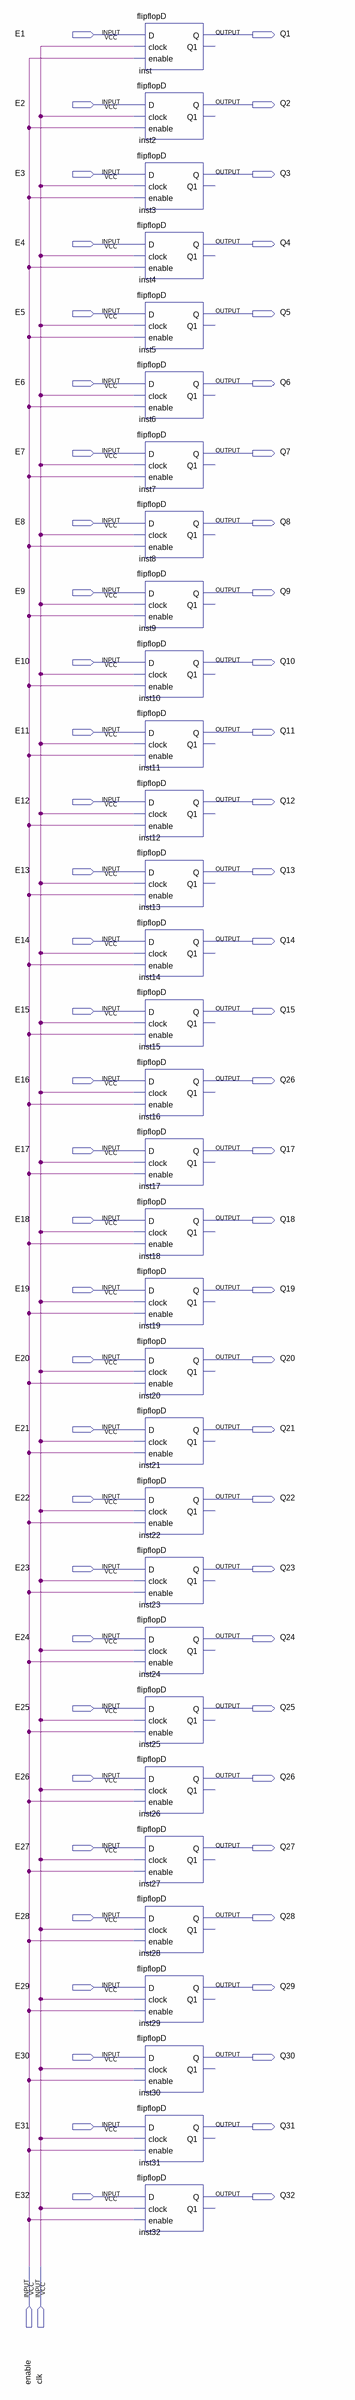
[diagram p0: schematic sheet]
// Quartus schematic reg32.bdf as structural Verilog: 32 symbols, 66 pins
module reg32 (
  input  E1,
  input  E2,
  input  E3,
  input  E4,
  input  E5,
  input  E6,
  input  E7,
  input  E8,
  input  E9,
  input  E10,
  input  E11,
  input  E12,
  input  E13,
  input  E14,
  input  E15,
  input  E16,
  input  E17,
  input  E18,
  input  E19,
  input  E20,
  input  E21,
  input  E22,
  input  E23,
  input  E24,
  input  E25,
  input  E26,
  input  E27,
  input  E28,
  input  E29,
  input  E30,
  input  E31,
  input  E32,
  input  enable,
  input  clk,
  output Q1,
  output Q2,
  output Q3,
  output Q4,
  output Q5,
  output Q6,
  output Q7,
  output Q8,
  output Q9,
  output Q10,
  output Q11,
  output Q12,
  output Q13,
  output Q14,
  output Q15,
  output Q26,
  output Q17,
  output Q18,
  output Q19,
  output Q20,
  output Q21,
  output Q22,
  output Q23,
  output Q24,
  output Q25,
  output Q27,
  output Q28,
  output Q29,
  output Q30,
  output Q31,
  output Q32
);

  flipflopD inst (.D(E1), .clock(clk), .enable(enable), .Q(Q1));  // open: Q1
  flipflopD inst2 (.D(E2), .clock(clk), .enable(enable), .Q(Q2));  // open: Q1
  flipflopD inst3 (.D(E3), .clock(clk), .enable(enable), .Q(Q3));  // open: Q1
  flipflopD inst4 (.D(E4), .clock(clk), .enable(enable), .Q(Q4));  // open: Q1
  flipflopD inst5 (.D(E5), .clock(clk), .enable(enable), .Q(Q5));  // open: Q1
  flipflopD inst6 (.D(E6), .clock(clk), .enable(enable), .Q(Q6));  // open: Q1
  flipflopD inst7 (.D(E7), .clock(clk), .enable(enable), .Q(Q7));  // open: Q1
  flipflopD inst8 (.D(E8), .clock(clk), .enable(enable), .Q(Q8));  // open: Q1
  flipflopD inst9 (.D(E9), .clock(clk), .enable(enable), .Q(Q9));  // open: Q1
  flipflopD inst10 (.D(E10), .clock(clk), .enable(enable), .Q(Q10));  // open: Q1
  flipflopD inst11 (.D(E11), .clock(clk), .enable(enable), .Q(Q11));  // open: Q1
  flipflopD inst12 (.D(E12), .clock(clk), .enable(enable), .Q(Q12));  // open: Q1
  flipflopD inst13 (.D(E13), .clock(clk), .enable(enable), .Q(Q13));  // open: Q1
  flipflopD inst14 (.D(E14), .clock(clk), .enable(enable), .Q(Q14));  // open: Q1
  flipflopD inst15 (.D(E15), .clock(clk), .enable(enable), .Q(Q15));  // open: Q1
  flipflopD inst16 (.D(E16), .clock(clk), .enable(enable), .Q(Q26));  // open: Q1
  flipflopD inst17 (.D(E17), .clock(clk), .enable(enable), .Q(Q17));  // open: Q1
  flipflopD inst18 (.D(E18), .clock(clk), .enable(enable), .Q(Q18));  // open: Q1
  flipflopD inst19 (.D(E19), .clock(clk), .enable(enable), .Q(Q19));  // open: Q1
  flipflopD inst20 (.D(E20), .clock(clk), .enable(enable), .Q(Q20));  // open: Q1
  flipflopD inst21 (.D(E21), .clock(clk), .enable(enable), .Q(Q21));  // open: Q1
  flipflopD inst22 (.D(E22), .clock(clk), .enable(enable), .Q(Q22));  // open: Q1
  flipflopD inst23 (.D(E23), .clock(clk), .enable(enable), .Q(Q23));  // open: Q1
  flipflopD inst24 (.D(E24), .clock(clk), .enable(enable), .Q(Q24));  // open: Q1
  flipflopD inst25 (.D(E25), .clock(clk), .enable(enable), .Q(Q25));  // open: Q1
  flipflopD inst26 (.D(E26), .clock(clk), .enable(enable), .Q(Q26));  // open: Q1
  flipflopD inst27 (.D(E27), .clock(clk), .enable(enable), .Q(Q27));  // open: Q1
  flipflopD inst28 (.D(E28), .clock(clk), .enable(enable), .Q(Q28));  // open: Q1
  flipflopD inst29 (.D(E29), .clock(clk), .enable(enable), .Q(Q29));  // open: Q1
  flipflopD inst30 (.D(E30), .clock(clk), .enable(enable), .Q(Q30));  // open: Q1
  flipflopD inst31 (.D(E31), .clock(clk), .enable(enable), .Q(Q31));  // open: Q1
  flipflopD inst32 (.D(E32), .clock(clk), .enable(enable), .Q(Q32));  // open: Q1
endmodule
